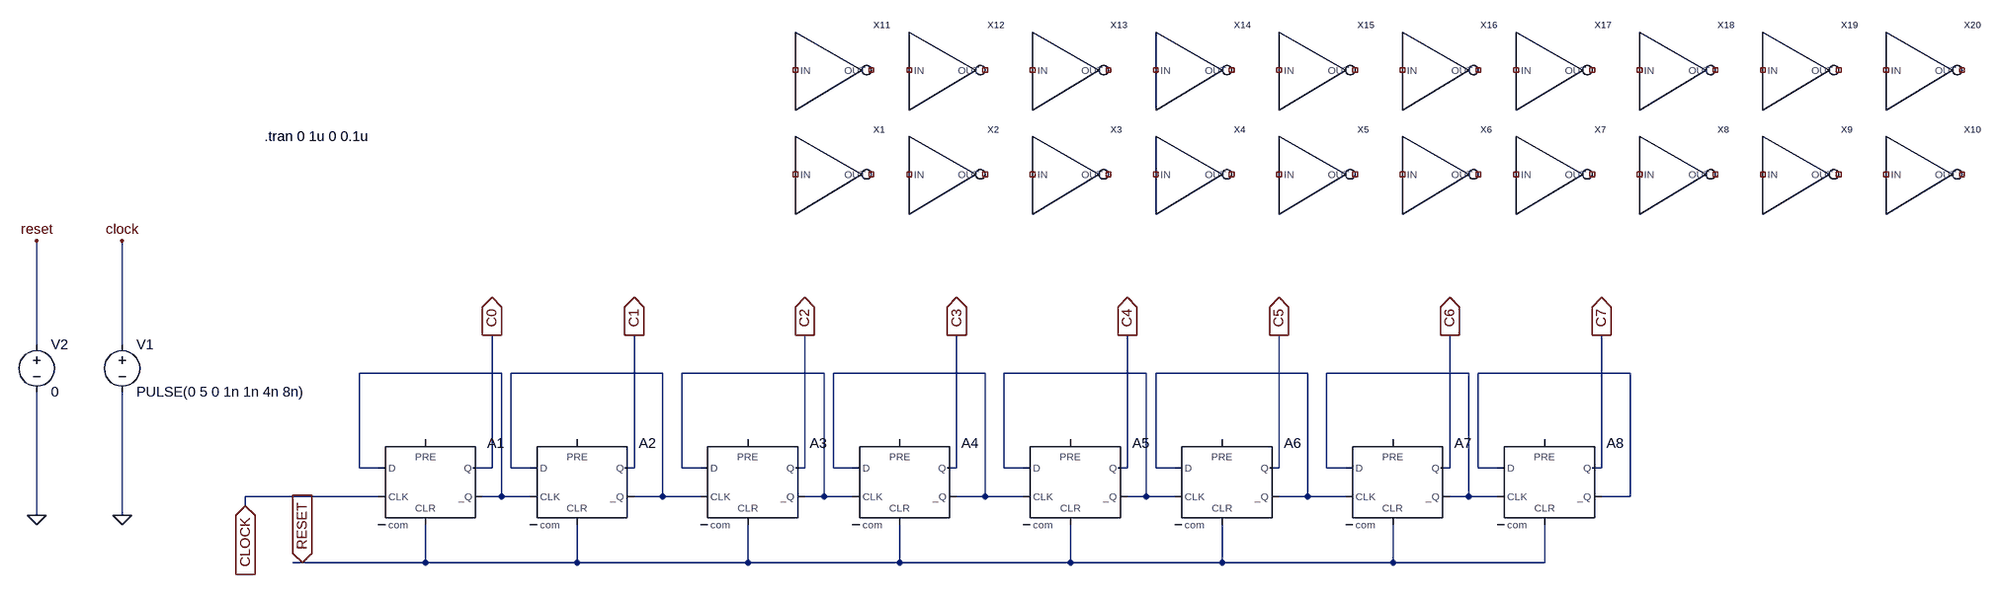
[diagram p0: schematic digi_part.asc]
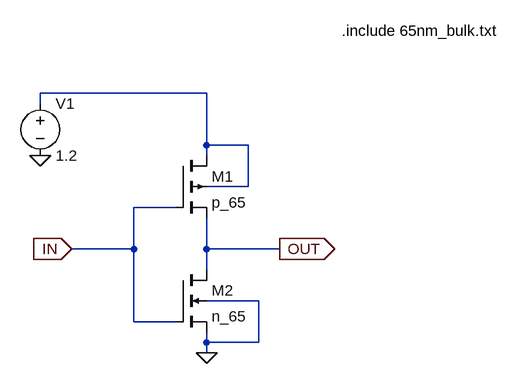
[diagram p1: sub-circuit cmos_inv.asc]
digi_part.asc, the LTspice schematic file:
Version 4
SHEET 1 2664 680
WIRE -592 -32 -592 -208
WIRE -448 -32 -448 -208
WIRE 192 16 -48 16
WIRE 464 16 208 16
WIRE 736 16 496 16
WIRE 1008 16 752 16
WIRE 1280 16 1040 16
WIRE 1552 16 1296 16
WIRE 1824 16 1584 16
WIRE 2096 16 1840 16
WIRE -48 176 -48 16
WIRE -16 176 -48 176
WIRE 176 176 176 -48
WIRE 176 176 144 176
WIRE 208 176 208 16
WIRE 240 176 208 176
WIRE 416 176 416 -48
WIRE 416 176 400 176
WIRE 496 176 496 16
WIRE 528 176 496 176
WIRE 704 176 704 -48
WIRE 704 176 688 176
WIRE 752 176 752 16
WIRE 784 176 752 176
WIRE 960 176 960 -48
WIRE 960 176 944 176
WIRE 1040 176 1040 16
WIRE 1072 176 1040 176
WIRE 1248 176 1248 -48
WIRE 1248 176 1232 176
WIRE 1296 176 1296 16
WIRE 1328 176 1296 176
WIRE 1504 176 1504 -48
WIRE 1504 176 1488 176
WIRE 1584 176 1584 16
WIRE 1616 176 1584 176
WIRE 1792 176 1792 -48
WIRE 1792 176 1776 176
WIRE 1840 176 1840 16
WIRE 1872 176 1840 176
WIRE 2048 176 2048 -48
WIRE 2048 176 2032 176
WIRE -16 224 -240 224
WIRE 192 224 192 16
WIRE 192 224 160 224
WIRE 240 224 192 224
WIRE 464 224 464 16
WIRE 464 224 416 224
WIRE 528 224 464 224
WIRE 736 224 736 16
WIRE 736 224 704 224
WIRE 784 224 736 224
WIRE 1008 224 1008 16
WIRE 1008 224 960 224
WIRE 1072 224 1008 224
WIRE 1280 224 1280 16
WIRE 1280 224 1248 224
WIRE 1328 224 1280 224
WIRE 1552 224 1552 16
WIRE 1552 224 1504 224
WIRE 1616 224 1552 224
WIRE 1824 224 1824 16
WIRE 1824 224 1792 224
WIRE 1872 224 1824 224
WIRE 2096 224 2096 16
WIRE 2096 224 2048 224
WIRE -240 240 -240 224
WIRE -592 256 -592 48
WIRE -448 256 -448 48
WIRE -144 336 -160 336
WIRE 64 336 64 272
WIRE 64 336 -144 336
WIRE 320 336 320 272
WIRE 320 336 64 336
WIRE 608 336 608 272
WIRE 608 336 320 336
WIRE 864 336 864 272
WIRE 864 336 608 336
WIRE 1152 336 1152 272
WIRE 1152 336 864 336
WIRE 1408 336 1408 272
WIRE 1408 336 1152 336
WIRE 1696 336 1696 272
WIRE 1696 336 1408 336
WIRE 1952 336 1952 272
WIRE 1952 336 1696 336
FLAG -144 336 RESET
IOPIN -144 336 In
FLAG -240 240 CLOCK
IOPIN -240 240 In
FLAG -448 256 0
FLAG -448 -208 clock
FLAG -592 256 0
FLAG -592 -208 reset
FLAG 176 -48 C0
IOPIN 176 -48 Out
FLAG 416 -48 C1
IOPIN 416 -48 Out
FLAG 704 -48 C2
IOPIN 704 -48 Out
FLAG 960 -48 C3
IOPIN 960 -48 Out
FLAG 1248 -48 C4
IOPIN 1248 -48 Out
FLAG 1504 -48 C5
IOPIN 1504 -48 Out
FLAG 1792 -48 C6
IOPIN 1792 -48 Out
FLAG 2048 -48 C7
IOPIN 2048 -48 Out
SYMBOL Digital/dflop 64 128 R0
SYMATTR InstName A1
SYMBOL Digital/dflop 320 128 R0
SYMATTR InstName A2
SYMBOL Digital/dflop 608 128 R0
SYMATTR InstName A3
SYMBOL Digital/dflop 864 128 R0
SYMATTR InstName A4
SYMBOL Digital/dflop 1152 128 R0
SYMATTR InstName A5
SYMBOL Digital/dflop 1408 128 R0
SYMATTR InstName A6
SYMBOL Digital/dflop 1696 128 R0
SYMATTR InstName A7
SYMBOL Digital/dflop 1952 128 R0
SYMATTR InstName A8
SYMBOL Voltage -448 -48 R0
SYMATTR InstName V1
SYMATTR Value PULSE(0 5 0 1n 1n 4n 8n)
SYMBOL Voltage -592 -48 R0
SYMATTR InstName V2
SYMATTR Value 0
SYMBOL CMOS_INV 736 -320 R0
SYMATTR InstName X1
SYMBOL CMOS_INV 928 -320 R0
SYMATTR InstName X2
SYMBOL CMOS_INV 1136 -320 R0
SYMATTR InstName X3
SYMBOL CMOS_INV 1344 -320 R0
SYMATTR InstName X4
SYMBOL CMOS_INV 1552 -320 R0
SYMATTR InstName X5
SYMBOL CMOS_INV 1760 -320 R0
SYMATTR InstName X6
SYMBOL CMOS_INV 1952 -320 R0
SYMATTR InstName X7
SYMBOL CMOS_INV 2160 -320 R0
SYMATTR InstName X8
SYMBOL CMOS_INV 2368 -320 R0
SYMATTR InstName X9
SYMBOL CMOS_INV 2576 -320 R0
SYMATTR InstName X10
SYMBOL CMOS_INV 736 -496 R0
SYMATTR InstName X11
SYMBOL CMOS_INV 928 -496 R0
SYMATTR InstName X12
SYMBOL CMOS_INV 1136 -496 R0
SYMATTR InstName X13
SYMBOL CMOS_INV 1344 -496 R0
SYMATTR InstName X14
SYMBOL CMOS_INV 1552 -496 R0
SYMATTR InstName X15
SYMBOL CMOS_INV 1760 -496 R0
SYMATTR InstName X16
SYMBOL CMOS_INV 1952 -496 R0
SYMATTR InstName X17
SYMBOL CMOS_INV 2160 -496 R0
SYMATTR InstName X18
SYMBOL CMOS_INV 2368 -496 R0
SYMATTR InstName X19
SYMBOL CMOS_INV 2576 -496 R0
SYMATTR InstName X20
TEXT -208 -384 Left 2 !.tran 0 1u 0 0.1u

cmos_inv.asc, the sub-circuit schematic file:
Version 4
SHEET 1 888 680
WIRE 432 80 176 80
WIRE 176 96 176 80
WIRE 432 160 432 80
WIRE 496 160 432 160
WIRE 432 176 432 160
WIRE 496 224 496 160
WIRE 496 224 432 224
WIRE 384 256 320 256
WIRE 320 320 320 256
WIRE 320 320 224 320
WIRE 432 320 432 272
WIRE 544 320 432 320
WIRE 432 352 432 320
WIRE 512 400 432 400
WIRE 320 432 320 320
WIRE 384 432 320 432
WIRE 432 464 432 448
WIRE 512 464 512 400
WIRE 512 464 432 464
WIRE 432 480 432 464
FLAG 224 320 IN
IOPIN 224 320 In
FLAG 544 320 OUT
IOPIN 544 320 Out
FLAG 176 176 0
FLAG 432 480 0
SYMBOL pmos4 384 176 R0
SYMATTR InstName M1
SYMATTR Value2 l=65n w=4u
SYMATTR Value p_65
SYMBOL nmos4 384 352 R0
SYMATTR InstName M2
SYMATTR Value2 l=65n w=2u
SYMATTR Value n_65
SYMBOL Voltage 176 80 R0
SYMATTR InstName V1
SYMATTR Value 1.2
TEXT 640 -16 Left 2 !.include 65nm_bulk.txt

The netlist it stands for:
* digi_part.asc
A1 N001 0 CLOCK 0 RESET N001 C0 0 DFLOP
A2 N002 0 N001 0 RESET N002 C1 0 DFLOP
A3 N003 0 N002 0 RESET N003 C2 0 DFLOP
A4 N004 0 N003 0 RESET N004 C3 0 DFLOP
A5 N005 0 N004 0 RESET N005 C4 0 DFLOP
A6 N006 0 N005 0 RESET N006 C5 0 DFLOP
A7 N007 0 N006 0 RESET N007 C6 0 DFLOP
A8 N008 0 N007 0 RESET N008 C7 0 DFLOP
V1 CLOCK 0 PULSE(0 5 0 1n 1n 4n 8n)
V2 RESET 0 0
XX1 NC_01 NC_02 cmos_inv
XX2 NC_03 NC_04 cmos_inv
XX3 NC_05 NC_06 cmos_inv
XX4 NC_07 NC_08 cmos_inv
XX5 NC_09 NC_10 cmos_inv
XX6 NC_11 NC_12 cmos_inv
XX7 NC_13 NC_14 cmos_inv
XX8 NC_15 NC_16 cmos_inv
XX9 NC_17 NC_18 cmos_inv
XX10 NC_19 NC_20 cmos_inv
XX11 NC_21 NC_22 cmos_inv
XX12 NC_23 NC_24 cmos_inv
XX13 NC_25 NC_26 cmos_inv
XX14 NC_27 NC_28 cmos_inv
XX15 NC_29 NC_30 cmos_inv
XX16 NC_31 NC_32 cmos_inv
XX17 NC_33 NC_34 cmos_inv
XX18 NC_35 NC_36 cmos_inv
XX19 NC_37 NC_38 cmos_inv
XX20 NC_39 NC_40 cmos_inv

* block symbol definitions
.subckt cmos_inv IN OUT
M1 N001 IN OUT N001 p_65 l=65n w=4u
M2 OUT IN 0 0 n_65 l=65n w=2u
V1 N001 0 1.2
.include 65nm_bulk.txt
.ends cmos_inv

.model NMOS NMOS
.model PMOS PMOS
.lib standard.mos
.tran 0 1u 0 0.1u
.backanno
.end